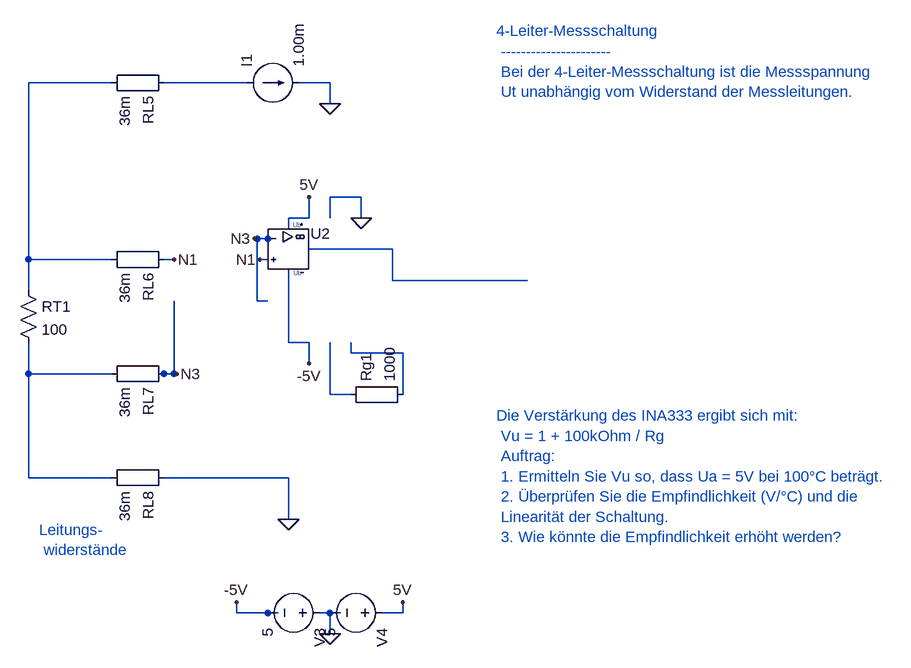
[diagram p0: schematic 1_5_1_PT100_Sensor_in_4-Leiter-Schaltung _mit_INA333.asc]
1_5_1_PT100_Sensor_in_4-Leiter-Schaltung _mit_INA333.asc, the LTspice schematic file:
Version 4
SHEET 1 880 680
WIRE 512 144 528 144
WIRE 464 384 448 384
WIRE 448 384 448 480
WIRE 448 480 464 480
WIRE 496 368 496 352
WIRE 496 352 528 352
WIRE 496 432 496 544
WIRE 496 544 528 544
WIRE 528 400 656 400
WIRE 656 400 656 448
WIRE 464 960 480 960
WIRE 560 960 576 960
WIRE 560 176 560 144
WIRE 560 144 528 144
WIRE 304 144 432 144
WIRE 224 144 96 144
WIRE 96 144 96 416
WIRE 96 544 96 592
WIRE 96 416 96 464
WIRE 224 416 96 416
WIRE 96 592 96 752
WIRE 96 752 224 752
WIRE 224 592 96 592
WIRE 496 816 496 752
WIRE 496 752 304 752
WIRE 320 480 320 592
WIRE 320 592 304 592
WIRE 608 352 608 320
WIRE 608 320 560 320
WIRE 560 320 560 352
WIRE 592 624 560 624
WIRE 560 624 560 544
WIRE 672 624 672 560
WIRE 672 560 592 560
WIRE 592 560 592 544
WIRE 528 320 528 352
WIRE 560 992 560 960
WIRE 560 960 544 960
WIRE 672 944 672 960
WIRE 672 960 640 960
WIRE 480 960 416 960
WIRE 416 960 416 944
WIRE 864 448 656 448
WIRE 528 576 528 544
WIRE 464 416 452 416
WIRE 304 416 320 416
WIRE 464 384 444 384
WIRE 304 592 324 592
FLAG 560 176 0
FLAG 608 352 0
FLAG 496 816 0
FLAG 560 992 0
FLAG 560 992 0
FLAG 560 176 0
FLAG 608 352 0
FLAG 496 816 0
FLAG 452 416 N1
FLAG 320 416 N1
FLAG 444 384 N3
FLAG 324 592 N3
FLAG 528 320 5V
FLAG 672 944 5V
FLAG 416 944 -5V
FLAG 528 576 -5V
SYMBOL current 432 144 R270
SYMATTR InstName I1
SYMATTR Value 1.00m
SYMBOL res 80 448 R0
SYMATTR InstName RT1
SYMATTR Value 100
SYMBOL Misc\EuropeanResistor 320 128 R90
SYMATTR InstName RL5
SYMATTR Value 36m
SYMBOL Misc\EuropeanResistor 320 400 R90
SYMATTR InstName RL6
SYMATTR Value 36m
SYMBOL Misc\EuropeanResistor 320 576 R90
SYMATTR InstName RL7
SYMATTR Value 36m
SYMBOL Misc\EuropeanResistor 320 736 R90
SYMATTR InstName RL8
SYMATTR Value 36m
SYMBOL UniversalOpAmp2 496 400 R0
SYMATTR InstName U2
SYMATTR Value UniversalOpAmp2
SYMBOL Misc\EuropeanResistor 576 640 R270
SYMATTR InstName Rg1
SYMATTR Value 1000
SYMBOL voltage 560 960 R90
SYMATTR InstName V3
SYMATTR Value 5
SYMBOL voltage 656 960 R90
SYMATTR InstName V4
SYMATTR Value 5
TEXT 816 64 Left 2 ;4-Leiter-Messschaltung \n ---------------------- \n Bei der 4-Leiter-Messschaltung ist die Messspannung \n Ut unabhängig vom Widerstand der Messleitungen.
TEXT 112 832 Left 2 ;Leitungs- \n widerstände
TEXT 816 656 Left 2 ;Die Verstärkung des INA333 ergibt sich mit: \n Vu = 1 + 100kOhm / Rg \n Auftrag: \n 1. Ermitteln Sie Vu so, dass Ua = 5V bei 100°C beträgt. \n 2. Überprüfen Sie die Empfindlichkeit (V/°C) und die \n Linearität der Schaltung. \n 3. Wie könnte die Empfindlichkeit erhöht werden?

The netlist it stands for:
* 1_5_1_PT100_Sensor_in_4-Leiter-Schaltung _mit_INA333.asc
I1 N002 0 1.00m
RT1 N003 N004 100
RL5 N002 N003 36m
RL6 N1 N003 36m
RL7 N3 N004 36m
RL8 0 N004 36m
XU2 N1 N3 5V -5V N001 level2 UniversalOpAmp2 Avol=1Meg GBW=10Meg Slew=10Meg Ilimit=25m Rail=0 Vos=0 En=0 Enk=0 In=0 Ink=0 Rin=500Meg  ; pins In+ In- V+ V- OUT
Rg1 N005 N006 1000
V3 0 -5V 5
V4 5V 0 5
* 4-Leiter-Messschaltung
*  ----------------------
*  Bei der 4-Leiter-Messschaltung ist die Messspannung
*  Ut unabhängig vom Widerstand der Messleitungen.
* Leitungs-
*  widerstände
* Die Verstärkung des INA333 ergibt sich mit:
*  Vu = 1 + 100kOhm / Rg
*  Auftrag:
*  1. Ermitteln Sie Vu so, dass Ua = 5V bei 100°C beträgt.
*  2. Überprüfen Sie die Empfindlichkeit (V/°C) und die
*  Linearität der Schaltung.
*  3. Wie könnte die Empfindlichkeit erhöht werden?
.lib UniversalOpAmp2.lib
.backanno
.end